# EAGLE schematic Lab2_Schematic (EAGLE 9.6.2)
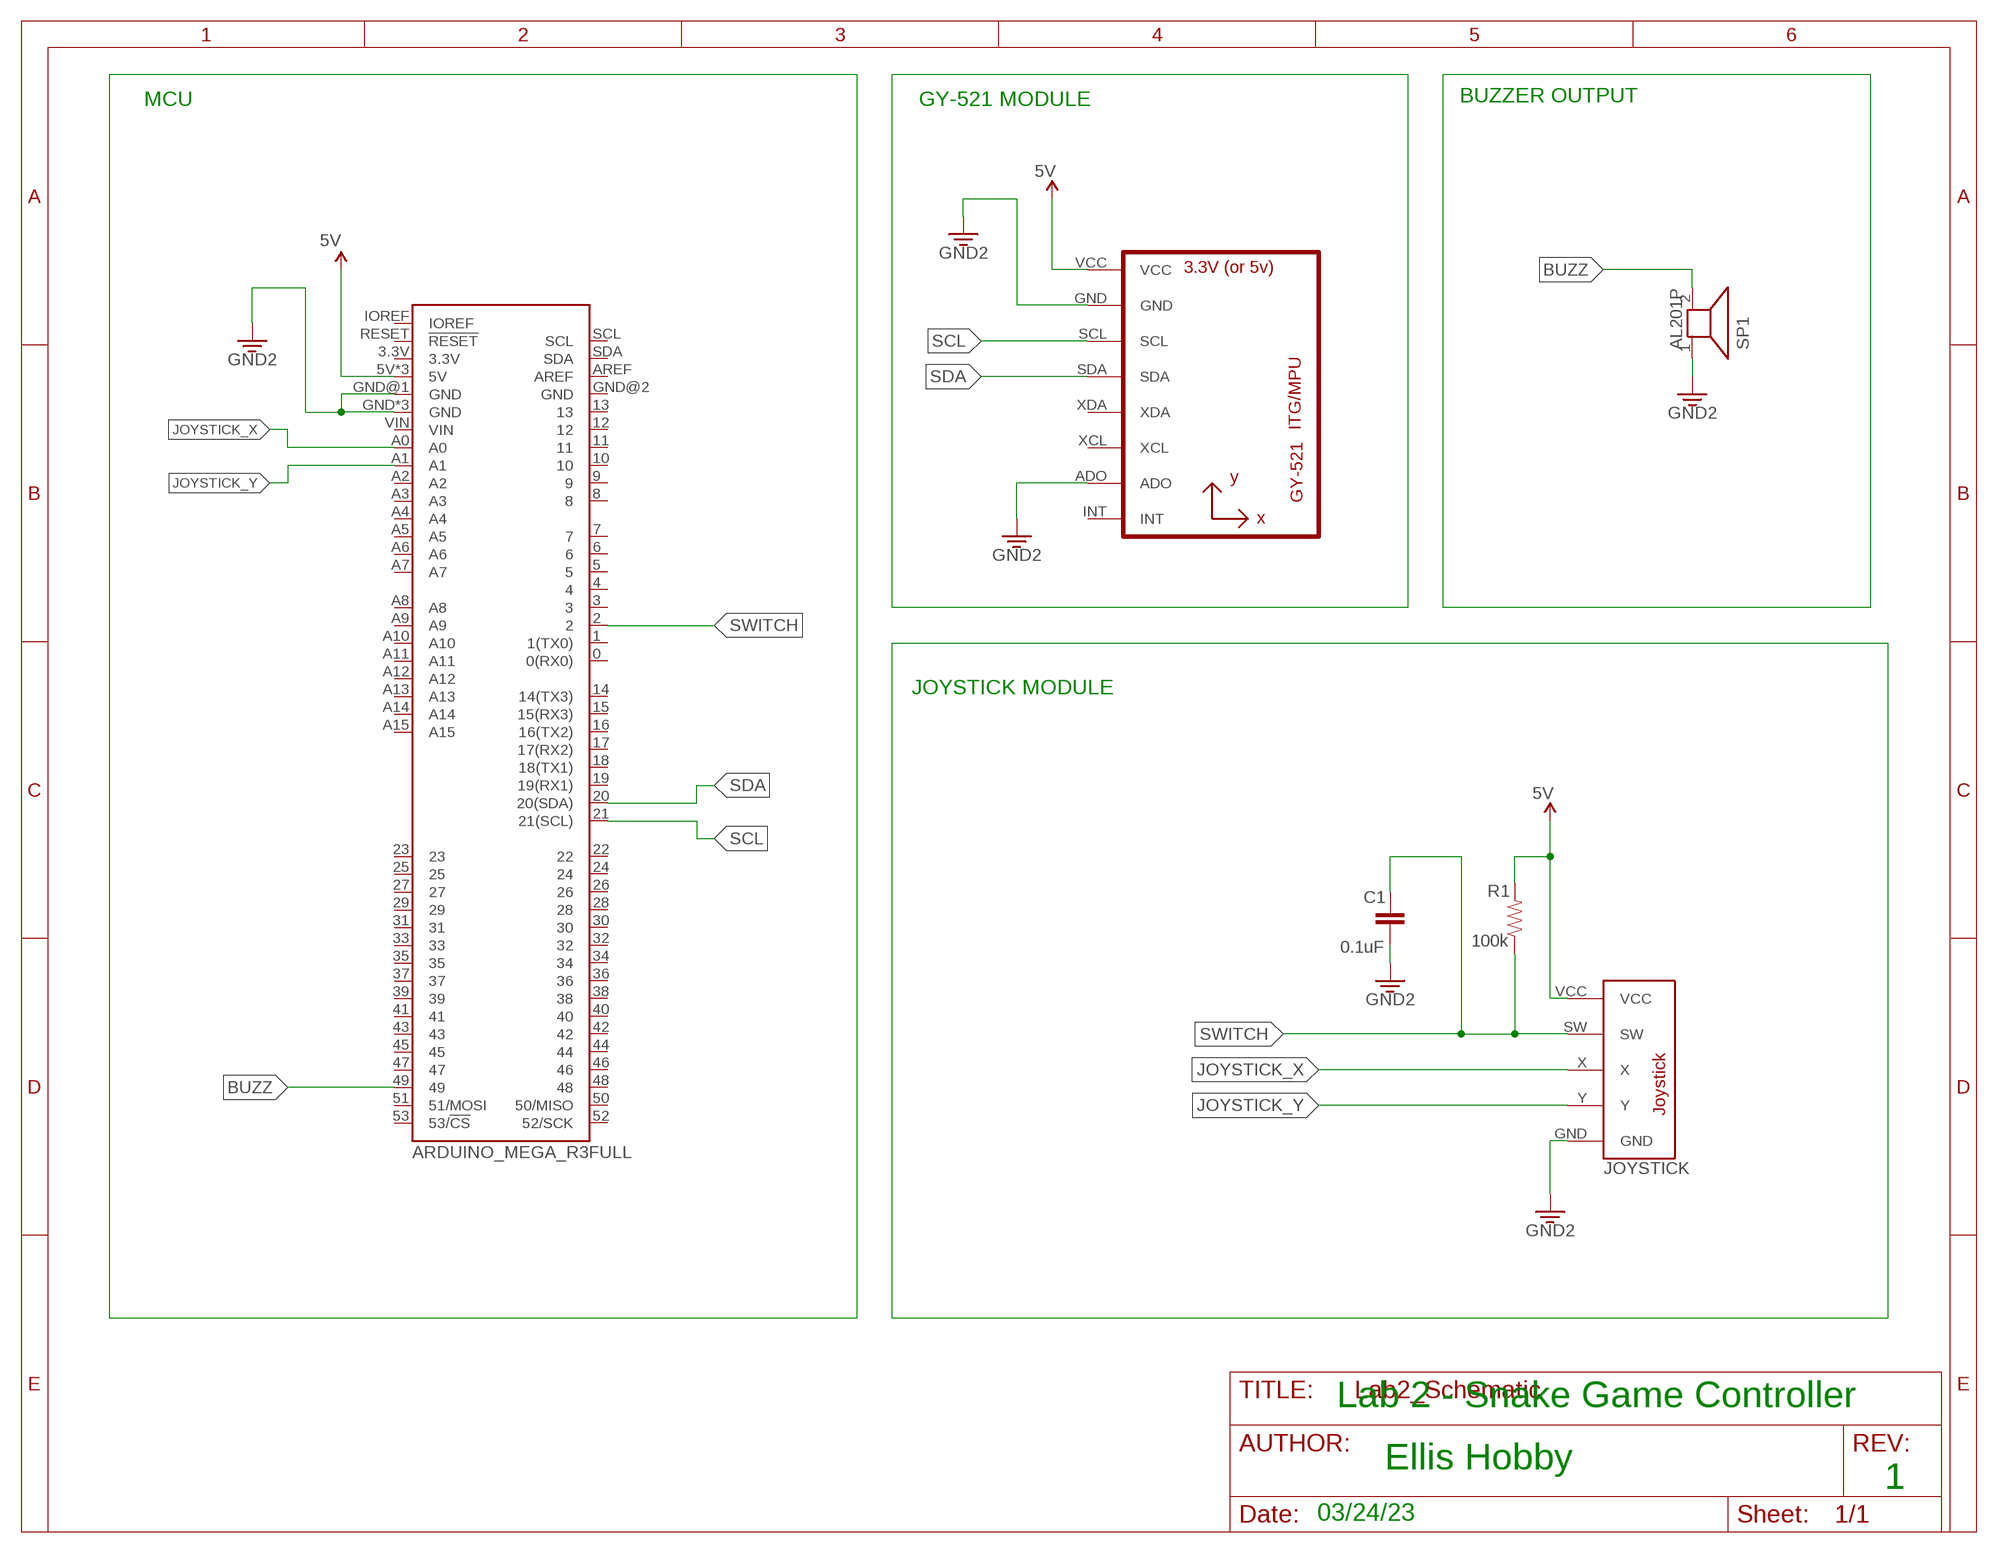
[diagram p0: schematic, sheet 1]

## Parts
B2  ARDUINO_MEGA_R3FULL  [ARDUINO_MEGA_NO_SILK]
C1  0.1uF  0.1UF-KIT-EZ-50V-20%  [CAP-PTH-SMALL-KIT]
R1  100k  1KOHM-HORIZ-1/4W-1%  [AXIAL-0.3]
SP1  AL201P  [AL201P]
SW1  JOYSTICK  JOYSTICK_SLIDE  [JOYSTICK-PSP1000]
U1  GY-521MPU6050  [GY-521]

## Nets
3.3V: B2.GND B2.GND@1(GND) B2.GND@3(GND) B2.GND@4(GND) C1.2 SP1.1 SW1.GND U1.ADO U1.GND ; supply symbol labelled GND2
5V: B2.5V B2.5V@1(5V) B2.5V@2(5V) R1.P$2 SW1.VCC U1.VCC
BUZZ: B2.49 SP1.2
JOYSTICK_X: B2.A0 SW1.X
JOYSTICK_Y: B2.A1 SW1.Y
SCL: B2.21(21(SCL)) U1.SCL
SDA: B2.20(20(SDA)) U1.SDA
SWITCH: B2.2 C1.1 R1.P$1 SW1.SW
Unconnected: B2.0(0(RX0)) B2.1(1(TX0)) B2.3 B2.3.3V B2.4 B2.5 B2.6 B2.7 B2.8 B2.9 B2.10 B2.11 B2.12 B2.13 B2.14(14(TX3)) B2.15(15(RX3)) B2.16(16(TX2)) B2.17(17(RX2)) B2.18(18(TX1)) B2.19(19(RX1)) B2.22 B2.23 B2.24 B2.25 B2.26 B2.27 B2.28 B2.29 B2.30 B2.31 B2.32 B2.33 B2.34 B2.35 B2.36 B2.37 B2.38 B2.39 B2.40 B2.41 B2.42 B2.43 B2.44 B2.45 B2.46 B2.47 B2.48 B2.50(50/MISO) B2.51(51/MOSI) B2.52(52/SCK) B2.53(53/!CS) B2.A2 B2.A3 B2.A4 B2.A5 B2.A6 B2.A7 B2.A8 B2.A9 B2.A10 B2.A11 B2.A12 B2.A13 B2.A14 B2.A15 B2.AREF B2.GND@2(GND) B2.IOREF B2.RESET(!RESET) B2.SCL B2.SDA B2.VIN U1.INT U1.XCL U1.XDA

## Notes on the sheet
- MCU | GY-521 MODULE | BUZZER OUTPUT
- JOYSTICK MODULE
- Lab 2 - Snake Game Controller
- Ellis Hobby
- 1
- 03/24/23

## Library data of the parts
B2 = SparkFun-Boards:ARDUINO_MEGA_R3: Arduino Mega R3 ATmega2560 R3 compatible footprint. SparkFun Products: Arduino Mega 2560 R3 <https://www.sparkfun.com/products/11061>
C1 = SparkFun-Capacitors:0.1UF: 0.1µF ceramic capacitors A capacitor is a passive two-terminal electrical component used to store electrical energy temporarily in an electric field.; PROD_ID: CAP-08370
R1 = SparkFun-Resistors:1KOHM: 1kΩ resistor A resistor is a passive two-terminal electrical component that implements electrical resistance as a circuit element. Resistors act to reduce current flow, and, at the same time, act to lower voltage levels within circuits. - Wikipedia; PROD_ID: RES-12182; VALUE: 1k
SP1 = buzzer:AL201P: SPEAKER Source: Buerklin; OC_FARNELL: unknown; OC_NEWARK: unknown
SW1 = Joystick:JOYSTICK_SLIDE: Resistive Thumb Slide Joystick This is a resistive analog joystick, very similar to those found on the PSP1000. These compact joysticks are different in that they have a very interesting ‘slide’ feeling. SparkFun Products Thumb Slide Joystick <https://www.sparkfun.com/products/9426> (COM-09426); SF_SKU: COM-09426
U1 = gy-521:GY-521